# EAGLE design instrument_glove (EAGLE 9.5.1)
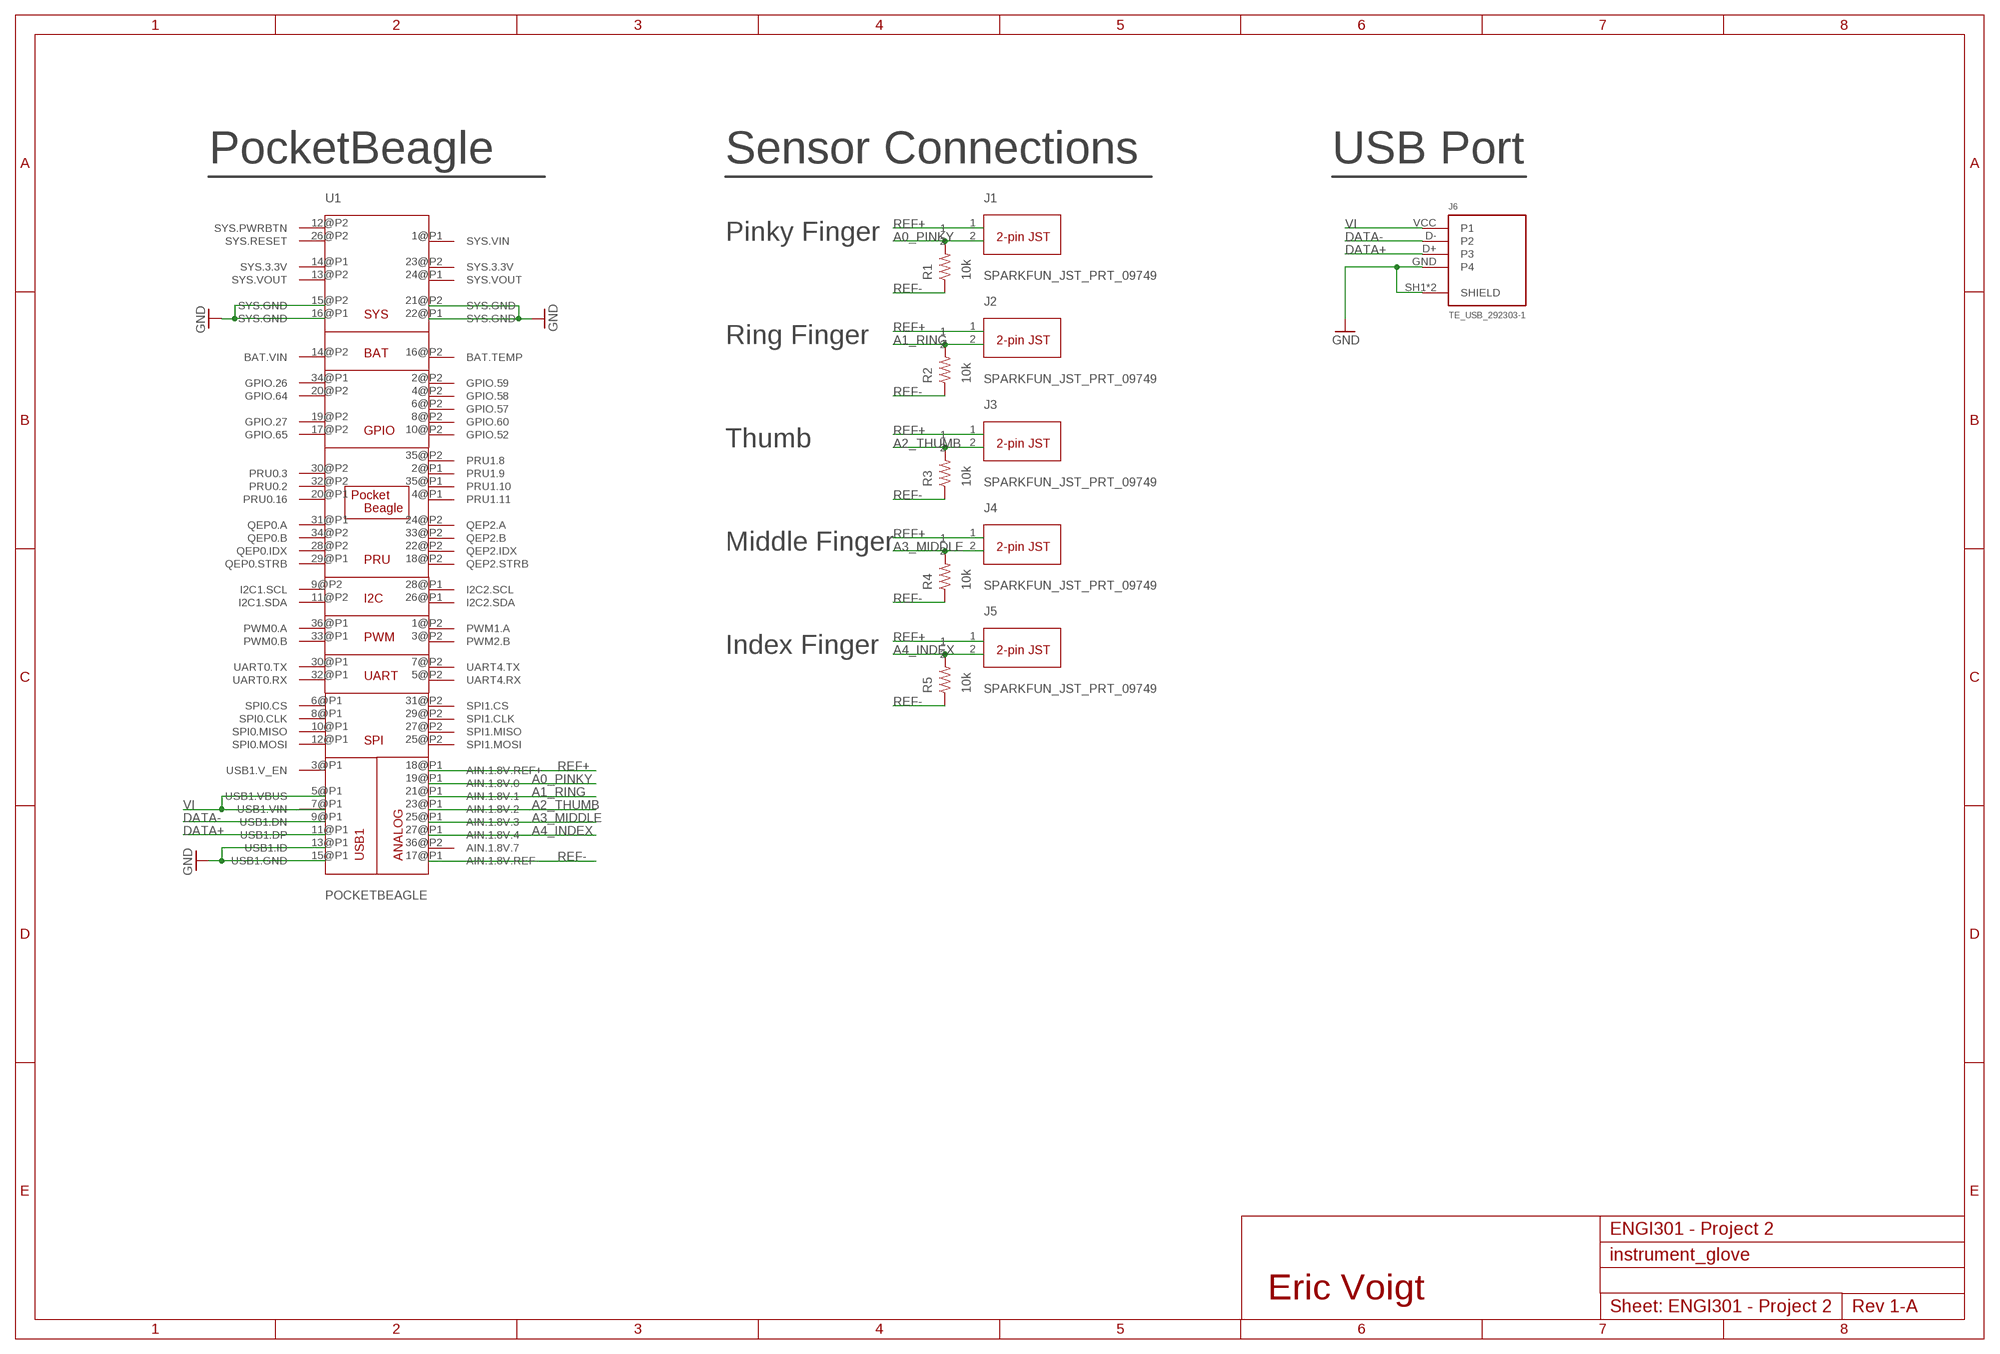
[diagram p0: schematic, sheet 1]

## Parts
J1  SPARKFUN_JST_PRT_09749  [SPARKFUN_JST_PRT_09749]
J2  SPARKFUN_JST_PRT_09749  [SPARKFUN_JST_PRT_09749]
J3  SPARKFUN_JST_PRT_09749  [SPARKFUN_JST_PRT_09749]
J4  SPARKFUN_JST_PRT_09749  [SPARKFUN_JST_PRT_09749]
J5  SPARKFUN_JST_PRT_09749  [SPARKFUN_JST_PRT_09749]
J6  TE_USB_292303-1  [TE_USB_292303-1]
R1  10k  R_R0603  [R0603]
R2  10k  R_R0603  [R0603]
R3  10k  R_R0603  [R0603]
R4  10k  R_R0603  [R0603]
R5  10k  R_R0603  [R0603]
U1  POCKETBEAGLE  [POCKETBEAGLE]

## Nets
A0_PINKY: J1.2 R1.2 U1.19@P1(AIN.1.8V.0)
A1_RING: J2.2 R2.2 U1.21@P1(AIN.1.8V.1)
A2_THUMB: J3.2 R3.2 U1.23@P1(AIN.1.8V.2)
A3_MIDDLE: J4.2 R4.2 U1.25@P1(AIN.1.8V.3)
A4_INDEX: J5.2 R5.2 U1.27@P1(AIN.1.8V.4)
DATA+: J6.D+(P3) U1.11@P1(USB1.DP)
DATA-: J6.D-(P2) U1.9@P1(USB1.DN)
GND: J6.GND(P4) J6.SH1(SHIELD) J6.SH2(SHIELD) U1.13@P1(USB1.ID) U1.15@P1(USB1.GND) U1.15@P2(SYS.GND) U1.16@P1(SYS.GND) U1.21@P2(SYS.GND) U1.22@P1(SYS.GND)
REF+: J1.1 J2.1 J3.1 J4.1 J5.1 U1.18@P1(AIN.1.8V.REF+)
REF-: R1.1 R2.1 R3.1 R4.1 R5.1 U1.17@P1(AIN.1.8V.REF-)
VI: J6.VCC(P1) U1.5@P1(USB1.VBUS) U1.7@P1(USB1.VIN)
Unconnected: U1.1@P1(SYS.VIN) U1.1@P2(PWM1.A) U1.2@P1(PRU1.9) U1.2@P2(GPIO.59) U1.3@P1(USB1.V_EN) U1.3@P2(PWM2.B) U1.4@P1(PRU1.11) U1.4@P2(GPIO.58) U1.5@P2(UART4.RX) U1.6@P1(SPI0.CS) U1.6@P2(GPIO.57) U1.7@P2(UART4.TX) U1.8@P1(SPI0.CLK) U1.8@P2(GPIO.60) U1.9@P2(I2C1.SCL) U1.10@P1(SPI0.MISO) U1.10@P2(GPIO.52) U1.11@P2(I2C1.SDA) U1.12@P1(SPI0.MOSI) U1.13@P2(SYS.VOUT) U1.14@P2(BAT.VIN) U1.16@P2(BAT.TEMP) U1.17@P2(GPIO.65) U1.18@P2(QEP2.STRB) U1.19@P2(GPIO.27) U1.20@P1(PRU0.16) U1.20@P2(GPIO.64) U1.22@P2(QEP2.IDX) U1.24@P1(SYS.VOUT) U1.24@P2(QEP2.A) U1.25@P2(SPI1.MOSI) U1.26@P1(I2C2.SDA) U1.27@P2(SPI1.MISO) U1.28@P1(I2C2.SCL) U1.28@P2(QEP0.IDX) U1.29@P1(QEP0.STRB) U1.29@P2(SPI1.CLK) U1.30@P1(UART0.TX) U1.30@P2(PRU0.3) U1.31@P1(QEP0.A) U1.31@P2(SPI1.CS) U1.32@P1(UART0.RX) U1.32@P2(PRU0.2) U1.33@P1(PWM0.B) U1.33@P2(QEP2.B) U1.34@P1(GPIO.26) U1.34@P2(QEP0.B) U1.35@P1(PRU1.10) U1.35@P2(PRU1.8) U1.36@P1(PWM0.A) U1.36@P2(AIN.1.8V.7)

## Notes on the sheet
- PocketBeagle | Sensor Connections | USB Port
- Pinky Finger
- Ring Finger
- Thumb
- Middle Finger
- Index Finger
- ENGI301 - Project 2
- Eric Voigt
- ENGI301 - Project 2

## Power pins joined to a net without a drawn wire
SYS.3.3V: U1.14@P1(SYS.3.3V) U1.23@P2(SYS.3.3V)
SYS.PWRBTN: U1.12@P2(SYS.PWRBTN)
SYS.RESET: U1.26@P2(SYS.RESET)

## Library data of the parts
J1-J5 = ENGI301_class:SPARKFUN_JST_PRT_09749: 2-PIN JST RIGHT ANGLE THROUGH-HOLE CONNECTOR
J6 = ENGI301_class:TE_USB_292303-1: CONN USB RECEPT R/A TYPE A 4POS; AVAILABILITY: Unavailable; CENTERLINE_PITCH: 2 mm[.078 in]; COMMENT: 292303-1; DESCRIPTION: Conn; Data; USB; Recept; 2.0; 4 Pos; 1 Port; Rt Angle; A Ser; Tin over Copper; EU_ROHS_COMPLIANCE: Compliant; MF: TE Connectivity; MP: 292303-1; NUMBER_OF_POSITIONS: 4; PACKAGE: None; PRICE: None; PRODUCT_TYPE: Connector; TE_PURCHASE_URL: https://www.te.com/usa-en/product-292303-1.html?te_bu=Cor&te_type=disp&te_campaign=seda_glo_cor-seda-global-disp-prtnr-fy19-seda-model-bom-cta_sma-317_1&elqCampaignId=32493
R1-R5 = ENGI301_class:R_: RESISTOR, American symbol
U1 = ENGI301_class:POCKETBEAGLE

## Board
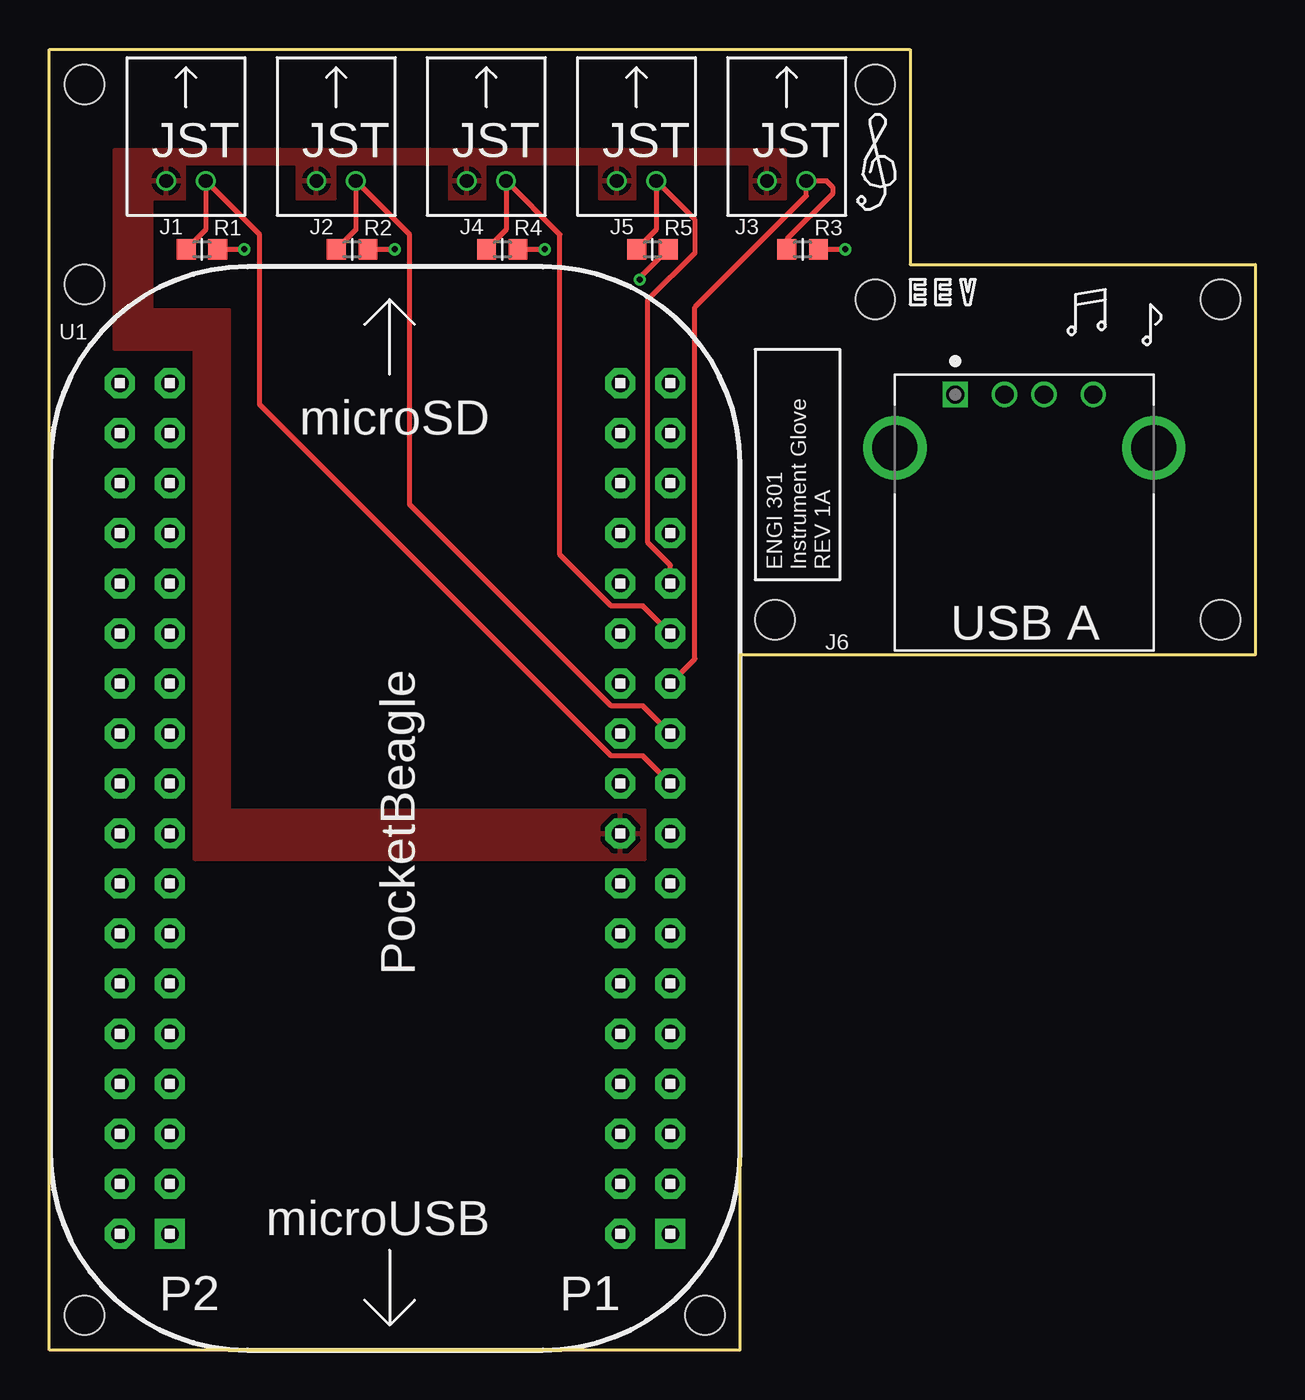
[diagram p1: board, top side]
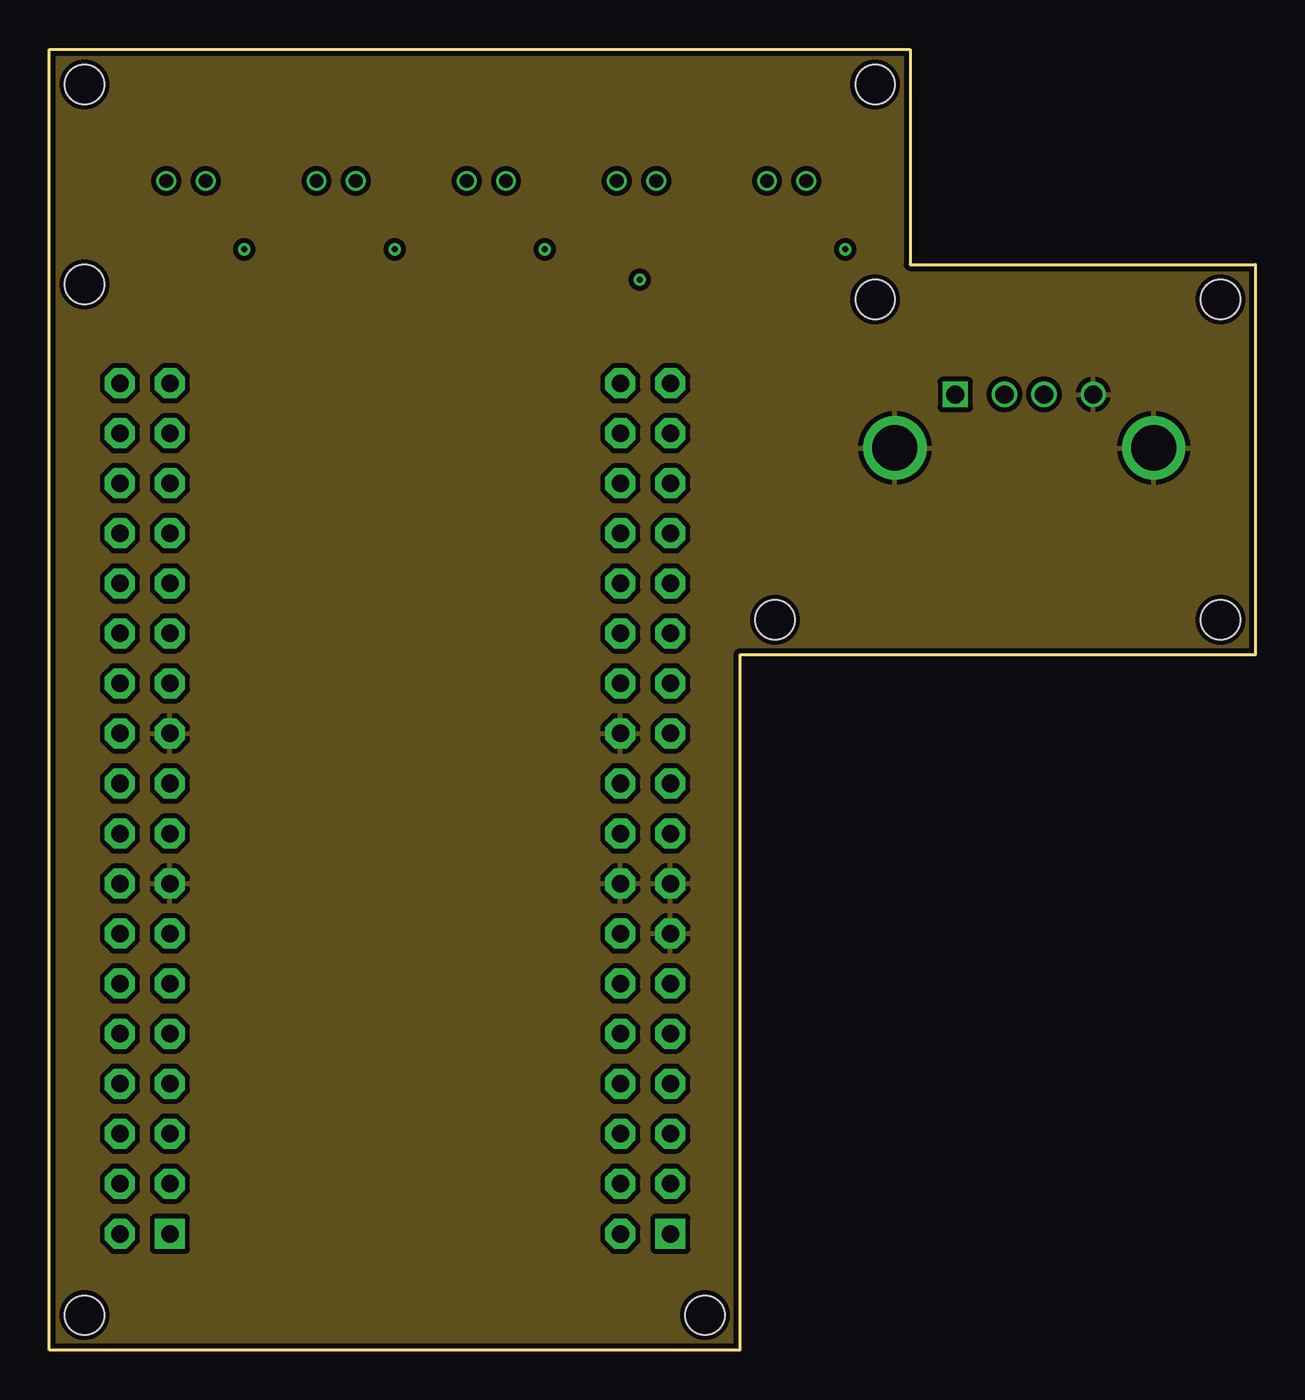
[diagram p2: board, inner layer Route2]
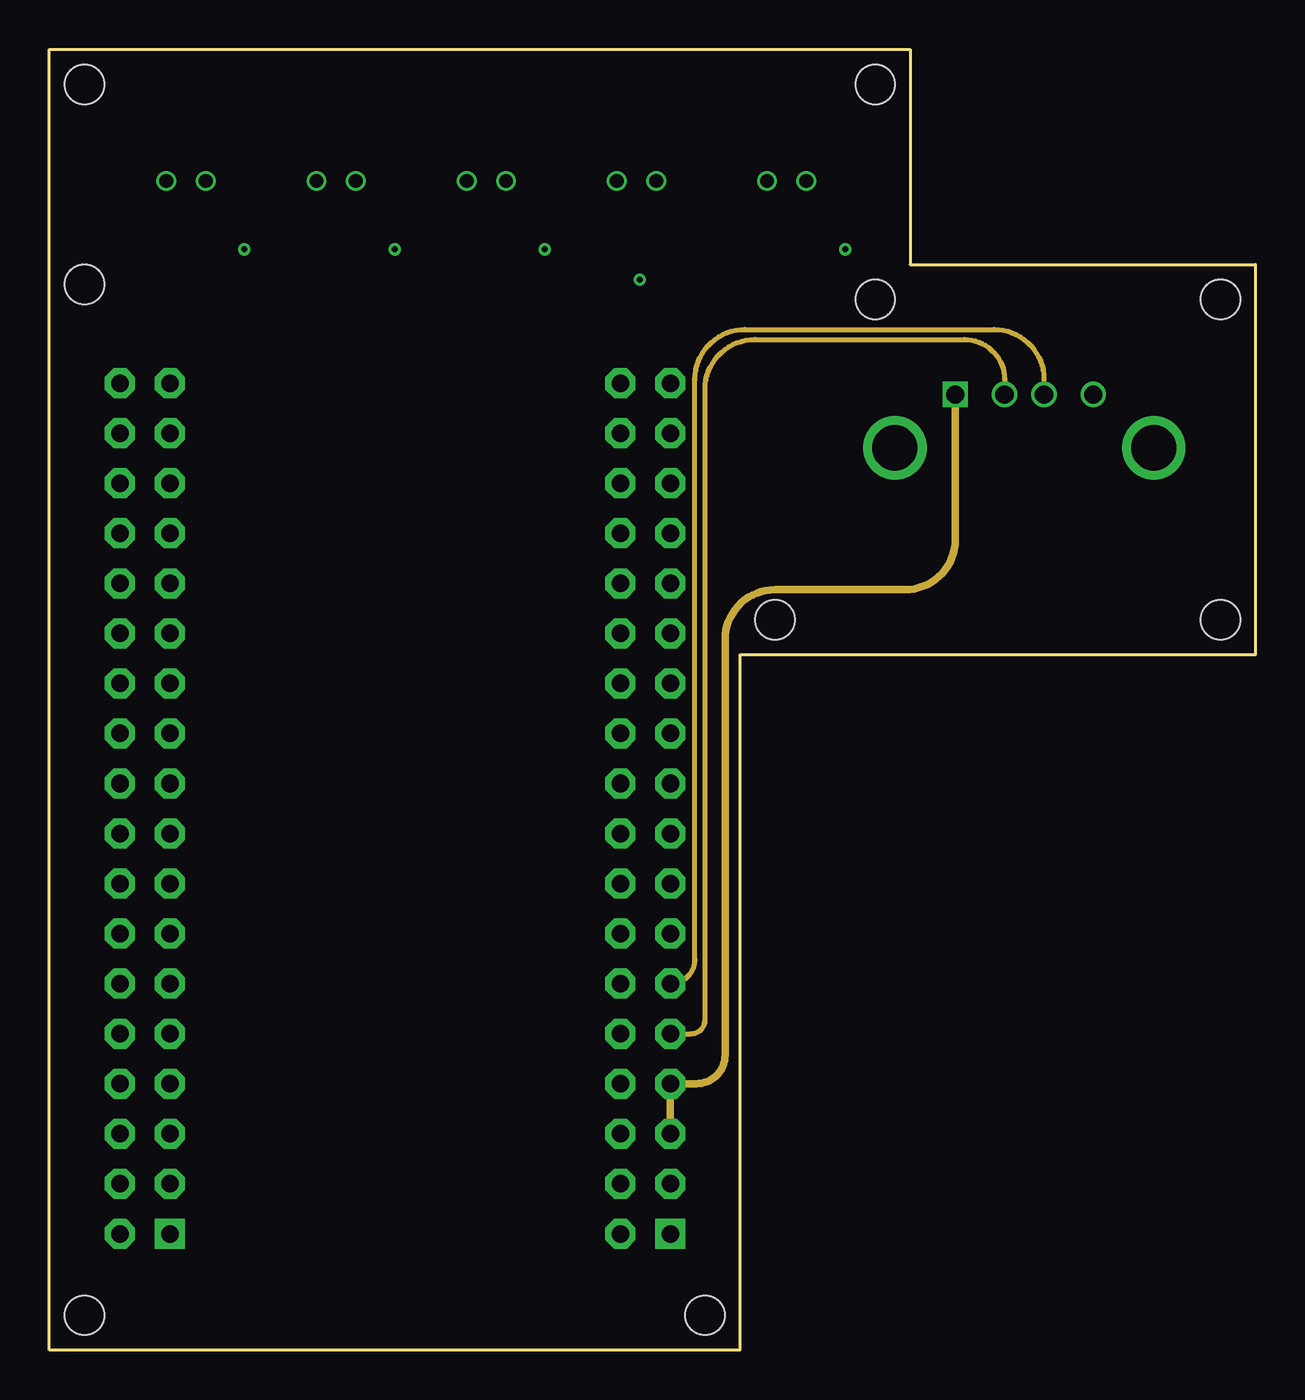
[diagram p3: board, inner layer Route15]
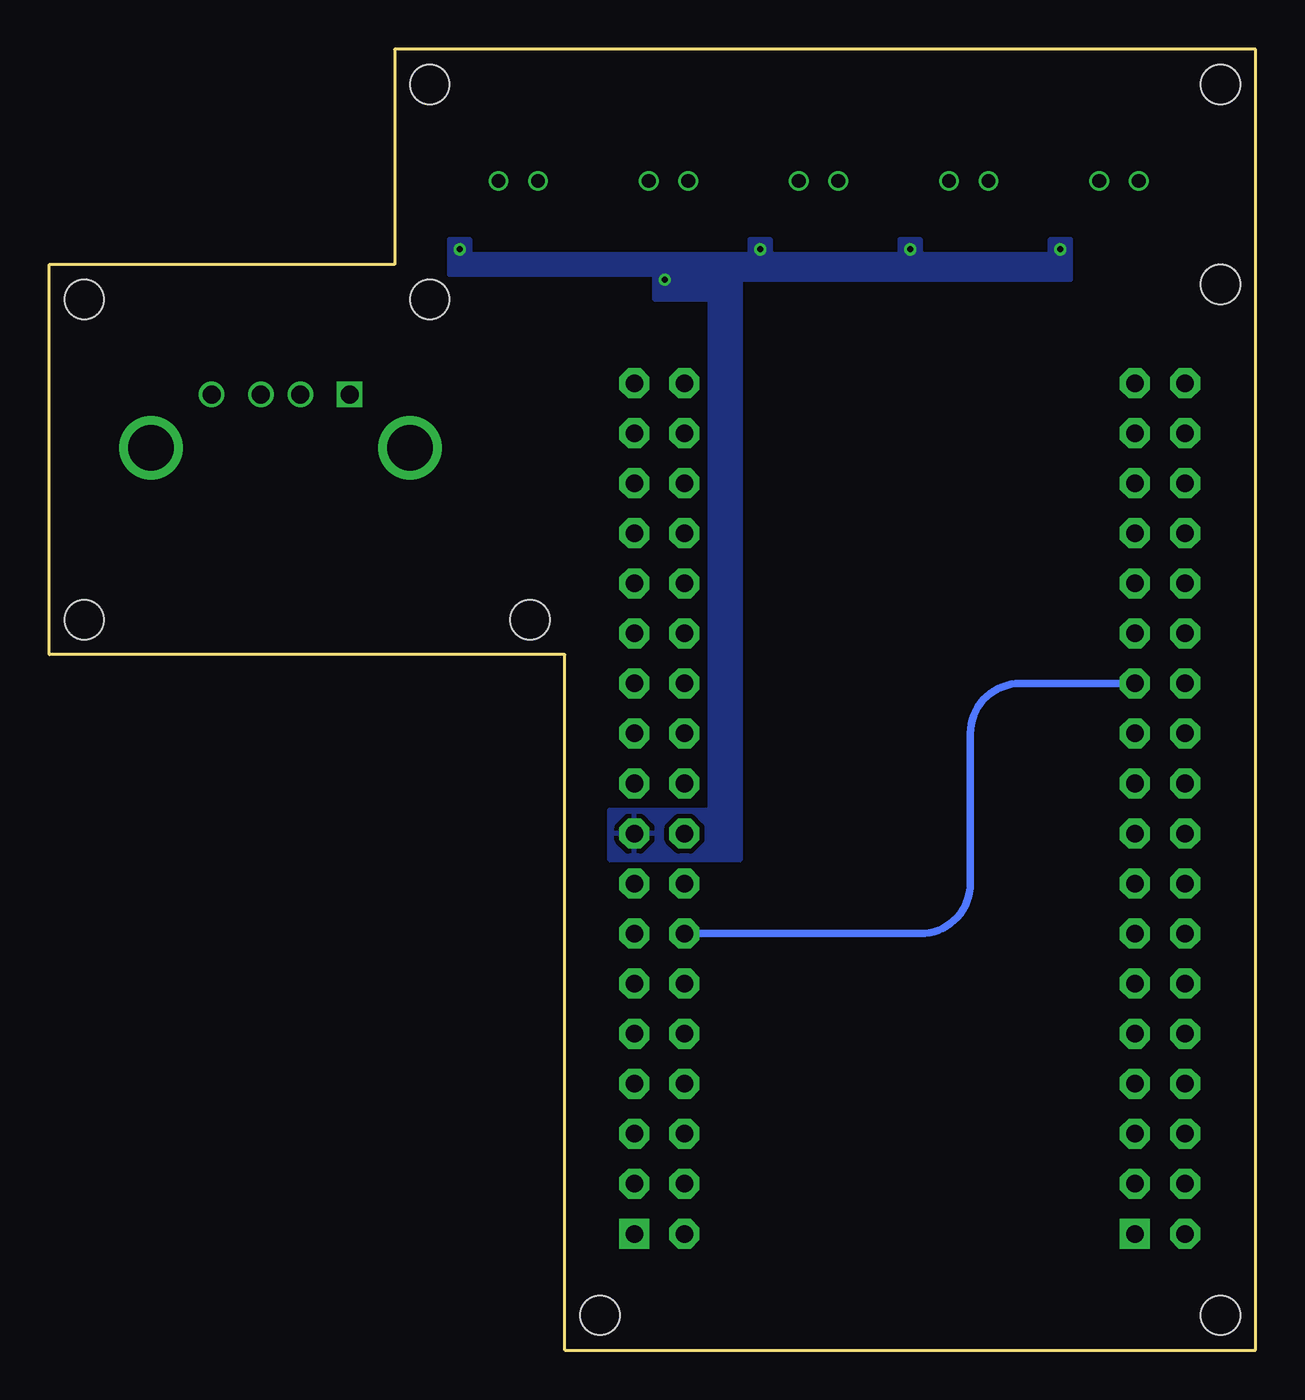
[diagram p4: board, bottom side, seen from below]

Size 61.21 x 66.04 mm. Coordinates in mm from the lower left corner, seen from the top.
Outline: 35.05,0 35.05,35.31 61.21,35.31 61.21,55.12 43.69,55.12 43.69,66.04 0,66.04 0,0 35.05,0
Copper layers (1*2*15*16): Top 0.035mm / dielectric 0.23mm / Route2 0.035mm / dielectric 0.93mm / Route15 0.035mm / dielectric 0.23mm / Bottom 0.035mm
Design rules "ENGI301_4lyr": minimum track width 10mil, minimum drill 12mil, track to track 10mil, track to pad 10mil, pad to pad 10mil, via to via 10mil, smd to smd 10mil, copper to edge 10mil, drill to drill 12mil, minimum pad ring 6mil, minimum via ring 6mil, stop-mask expansion 3mil, vias tented up to drill 25mil, thermal gap 10mil
Holes 2 mm at 1.78,64.26 1.78,1.78 33.27,1.78 41.91,64.26 41.91,53.34 36.83,37.08 1.78,54.1 59.44,37.08 59.44,53.34

### Footprints (pad centres in the part's own frame; a part is rotated, then mirrored left to right if it is on the bottom)
SPARKFUN_JST_PRT_09749 = drill 0.7: 1 2,4.75; 2 4,4.75
TE_USB_292303-1 = drill 0.92: D+ 4.5,0; D- 2.5,0; GND 7,0 | drill 2.3: SH1 -3.07,-2.71; SH2 10.07,-2.71 | drill 0.92 square: VCC 0,0
R0603 = smd 0.95 x 1.031: 1 -0.8,0; 2 0.8,0
POCKETBEAGLE = drill 0.889 pad 1.524 square: 1@P1 5.91,6.07; 1@P2 5.91,31.47 | drill 0.889 pad 1.524 octagon: 2@P1 5.91,8.61; 2@P2 5.91,34.01; 3@P1 8.45,6.07; 3@P2 8.45,31.47; 4@P1 8.45,8.61; 4@P2 8.45,34.01; 5@P1 10.99,6.07; 5@P2 10.99,31.47; 6@P1 10.99,8.61; 6@P2 10.99,34.01; 7@P1 13.53,6.07; 7@P2 13.53,31.47; 8@P1 13.53,8.61; 8@P2 13.53,34.01; 9@P1 16.07,6.07; 9@P2 16.07,31.47; 10@P1 16.07,8.61; 10@P2 16.07,34.01; 11@P1 18.61,6.07; 11@P2 18.61,31.47; 12@P1 18.61,8.61; 12@P2 18.61,34.01; 13@P1 21.15,6.07; 13@P2 21.15,31.47; 14@P1 21.15,8.61; 14@P2 21.15,34.01; 15@P1 23.69,6.07; 15@P2 23.69,31.47; 16@P1 23.69,8.61; 16@P2 23.69,34.01; 17@P1 26.23,6.07; 17@P2 26.23,31.47; 18@P1 26.23,8.61; 18@P2 26.23,34.01; 19@P1 28.77,6.07; 19@P2 28.77,31.47; 20@P1 28.77,8.61; 20@P2 28.77,34.01; 21@P1 31.31,6.07; 21@P2 31.31,31.47; 22@P1 31.31,8.61; 22@P2 31.31,34.01; 23@P1 33.85,6.07; 23@P2 33.85,31.47; 24@P1 33.85,8.61; 24@P2 33.85,34.01; 25@P1 36.39,6.07; 25@P2 36.39,31.47; 26@P1 36.39,8.61; 26@P2 36.39,34.01; 27@P1 38.93,6.07; 27@P2 38.93,31.47; 28@P1 38.93,8.61; 28@P2 38.93,34.01; 29@P1 41.47,6.07; 29@P2 41.47,31.47; 30@P1 41.47,8.61; 30@P2 41.47,34.01; 31@P1 44.01,6.07; 31@P2 44.01,31.47; 32@P1 44.01,8.61; 32@P2 44.01,34.01; 33@P1 46.55,6.07; 33@P2 46.55,31.47; 34@P1 46.55,8.61; 34@P2 46.55,34.01; 35@P1 49.09,6.07; 35@P2 49.09,31.47; 36@P1 49.09,8.61; 36@P2 49.09,34.01

### Placement (x,y rotation side)
J1  3.94,54.61 0 top
J2  11.56,54.61 0 top
J3  34.42,54.61 0 top
J4  19.18,54.61 0 top
J5  26.8,54.61 0 top
J6  45.97,48.51 0 top
R1  7.75,55.88 180 top
R2  15.37,55.88 180 top
R3  38.23,55.88 180 top
R4  22.99,55.88 180 top
R5  30.61,55.88 180 top
U1  37.59,0 90 top

### Tracks (layer width: path | path; a pad name or v marks a point on that pad's centre or on a via)
A0_PINKY
  Top 0.254: U1.19@P1 30.12,30.17 28.51,30.17 10.67,48.01 10.67,56.63 J1.2 7.94,56.87 R1.2
A1_RING
  Top 0.254: U1.21@P1 30.12,32.71 28.51,32.71 18.29,42.93 18.29,56.63 J2.2 15.56,56.87 R2.2
A2_THUMB
  Top 0.254: U1.23@P1 32.77,35.09 32.77,52.95 38.42,58.6 J3.2 39.43,59.36 39.74,59.05 39.74,58.71 37.43,56.39 R3.2
A3_MIDDLE
  Top 0.254: U1.25@P1 30.12,37.79 28.51,37.79 25.91,40.39 25.91,56.63 J4.2 23.18,56.87 R4.2
A4_INDEX
  Top 0.254: R5.2 30.8,56.87 J5.2 32.77,57.39 32.77,55.72 30.38,53.32 30.38,41 31.52,39.85 U1.27@P1
DATA+
  Route15 0.254: U1.11@P1 arc90 32.77,19.85 32.77,49.28 arc-90 35.31,51.82 47.93,51.82 arc-90 50.47,49.28 J6.D+
DATA-
  Route15 0.254: J6.D- 48.47,49.28 arc90 46.44,51.31 35.81,51.31 arc90 33.27,48.77 33.27,16.76 arc-90 32.58,16.07 U1.9@P1
GND
  pour Route2: -0.51,-0.51 35.56,-0.51 35.56,34.8 61.72,34.8 61.72,55.75 44.2,55.75 44.2,66.55 -0.51,66.55
REF+
  pour Top: 30.23,27.43 30.23,24.89 7.37,24.89 7.37,50.8 3.3,50.8 3.3,60.96 37.34,60.96 37.34,58.42 35.56,58.42 35.56,60.2 29.72,60.2 29.72,58.42 27.94,58.42 27.94,60.2 22.1,60.2 22.1,58.42 20.32,58.42 20.32,60.2 14.48,60.2 14.48,58.42 12.57,58.42 12.57,60.2 6.86,60.2 6.86,58.42 5.21,58.42 5.21,52.83 9.14,52.83 9.14,27.43
REF-  (via drill 0.3)
  Top 0.254: R1.1 v9.91,55.88 | R2.1 v17.53,55.88 | R4.1 v25.15,55.88 | R5.1 29.97,54.45 v29.97,54.36 | R3.1 v40.39,55.88
  pour Bottom: 32.77,24.89 32.77,27.43 27.69,27.43 27.69,53.34 30.48,53.34 30.48,54.61 40.89,54.61 40.89,56.39 39.88,56.39 39.88,55.63 25.65,55.63 25.65,56.39 24.64,56.39 24.64,55.63 18.03,55.63 18.03,56.39 17.02,56.39 17.02,55.63 10.41,55.63 10.41,56.39 9.4,56.39 9.4,54.36 26.16,54.36 26.16,24.89
SYS.3.3V
  Bottom 0.381: U1.23@P2 11.94,33.85 arc-90 14.48,31.31 14.48,23.69 arc90 17.02,21.15 U1.14@P1
VI
  Route15 0.381: U1.5@P1 U1.7@P1 32.83,13.53 arc90 34.29,14.99 34.29,36.07 arc-90 36.83,38.61 43.43,38.61 arc90 45.97,41.15 J6.VCC

### Text on the board
tPlace: ENGI 301 / Instrument Glove / REV 1A | USB A